# Altium schematic sheet FC-16.SchDoc
size A4; SheetNumber: 2; SheetTotal: 2
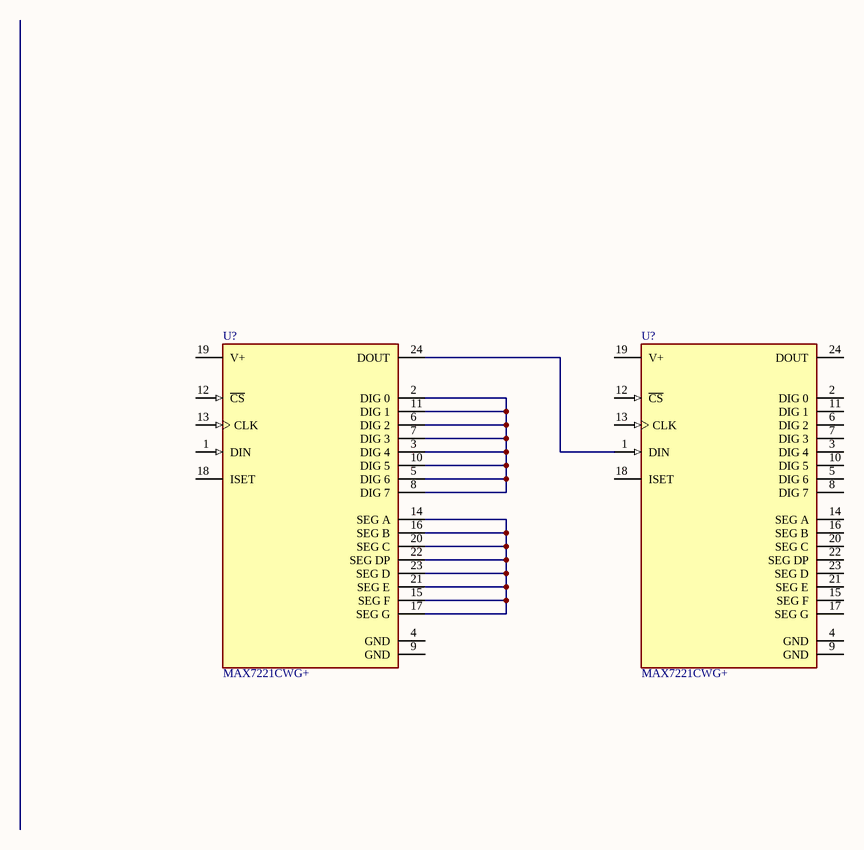
[diagram p0: FC-16.SchDoc]

## Parts
(Parts that share a designator on the sheet are numbered #1, #2 ... from top to bottom, then left to right.)
U?#1  MAX7221CWG+  [FP-W24-1-MFG]
U?#2  MAX7221CWG+  [FP-W24-1-MFG]

## Nets
NetU?#1_2: U?#1.2(DIG_0) U?#1.3(DIG_4) U?#1.5(DIG_6) U?#1.6(DIG_2) U?#1.7(DIG_3) U?#1.8(DIG_7) U?#1.10(DIG_5) U?#1.11(DIG_1)
NetU?#1_14: U?#1.14(SEG_A) U?#1.15(SEG_F) U?#1.16(SEG_B) U?#1.17(SEG_G) U?#1.20(SEG_C) U?#1.21(SEG_E) U?#1.22(SEG_DP) U?#1.23(SEG_D)
NetU?#1_24: U?#1.24(DOUT) U?#2.1(DIN)

Not connected (* = marked no-connect by the designer): U?#1 1(DIN) 4(GND) 9(GND) 12(~{CS}) 13(CLK) 18(ISET) 19(V+); U?#2 2(DIG_0) 3(DIG_4) 4(GND) 5(DIG_6) 6(DIG_2) 7(DIG_3) 8(DIG_7) 9(GND) 10(DIG_5) 11(DIG_1) 12(~{CS}) 13(CLK) 14(SEG_A) 15(SEG_F) 16(SEG_B) 17(SEG_G) 18(ISET) 19(V+) 20(SEG_C) 21(SEG_E) 22(SEG_DP) 23(SEG_D) 24(DOUT)

## Library data of the parts
U?#1 U?#2 = CMP-05718-000002-1: IC DRVR 7 SEGMNT 8 DIGIT 24SOIC; Manufacturer: Maxim Integrated; Nominal Supply Current: 330mA; Max Power Dissipation: 941mW; Standoff Height: 0.1mm; Min Supply Voltage: 4V; Max Supply Voltage: 5.5V; Description: LED Driver 24-SOIC; Max Junction Temp: +150°C; Number Of Outputs: 8; Lead Free: Yes; Device Class L2: Power Management ICs; Height: 2.65mm; Temperature: 0°C to +70°C; Category: IC; Ipc Land Pattern Name: SOIC127P1032X250-24; Temperature Range High: +70°C; Package: W24-1; Manufacturer Part Number: MAX7221CWG+; Device Class L3: LED Drivers; ComponentLink2URL: https://datasheets.maximintegrated.com/en/ds/MAX7219-MAX7221.pdf; Temperature Range Low: 0°C; Device Class L1: Integrated Circuits (ICs); ComponentLink2Description: Datasheet; Digikey Description: IC DRVR 7 SEGMNT 8 DIGIT 24SOIC; Mouser Description: In a Tube of 30, Maxim MAX7221CWG+, LED Driver, 8-Digits 64-Segments, 5 V, 24-Pin SOIC W; RoHS: TRUE; Octopart: https://octopart.com/max7221cwg%2B-maxim+integrated-39581478; Automotive: No; Footprint Url: https://pdfserv.maximintegrated.com/land_patterns/90-0182.PDF